# Altium schematic sheet A2-ESP.SchDoc
size A
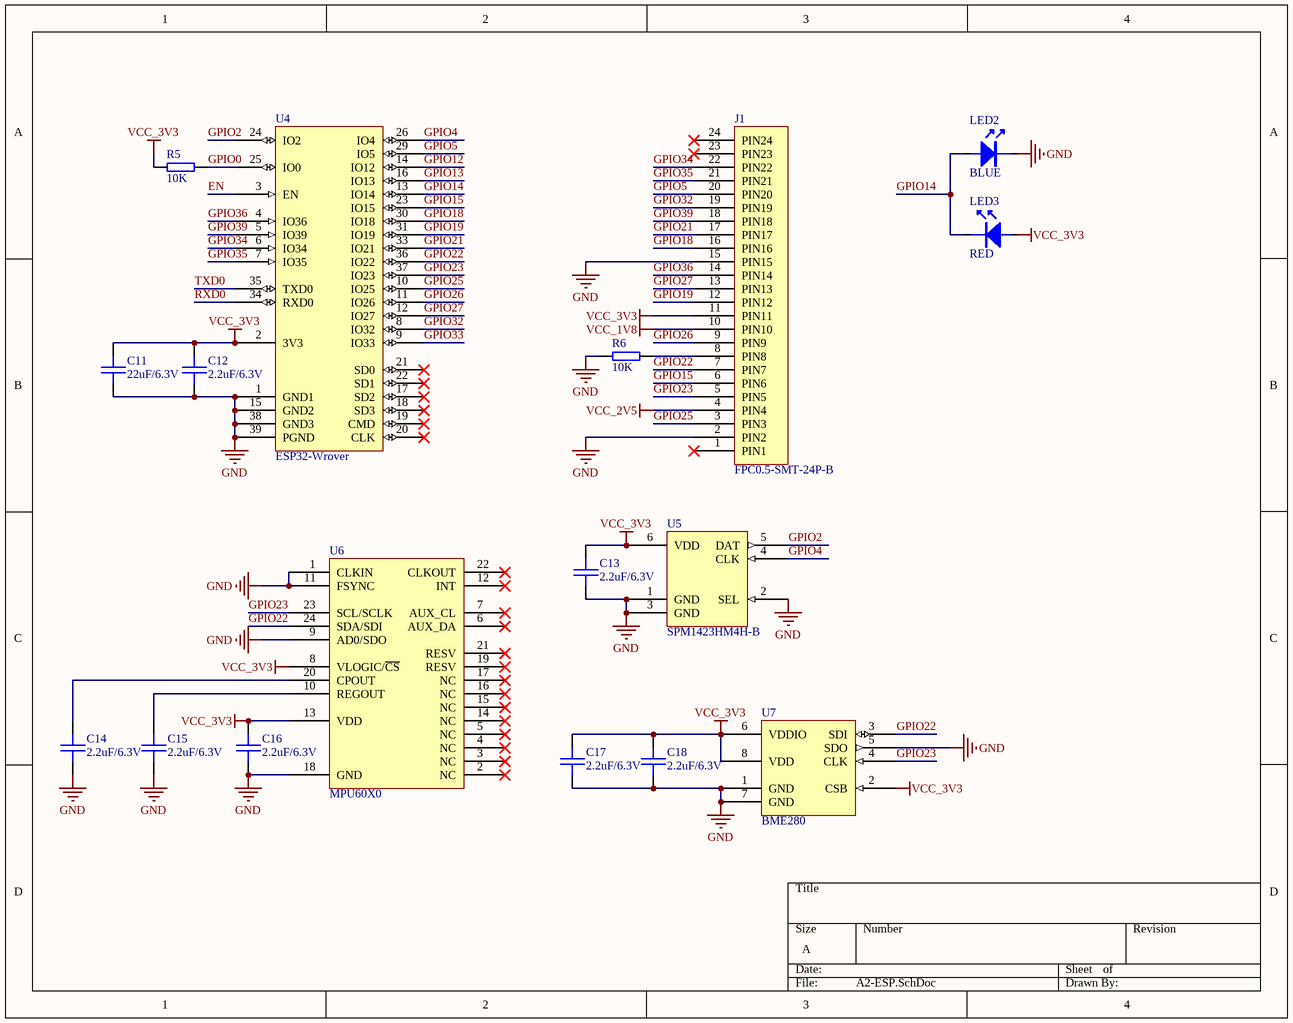
[diagram p0: A2-ESP.SchDoc]

## Parts
C11  22uF/6.3V  [SMT_C_0805]
C12  2.2uF/6.3V  [SMT_C_0402]
C13  2.2uF/6.3V  [SMT_C_0402]
C14  2.2uF/6.3V  [SMT_C_0402]
C15  2.2uF/6.3V  [SMT_C_0402]
C16  2.2uF/6.3V  [SMT_C_0402]
C17  2.2uF/6.3V  [SMT_C_0402]
C18  2.2uF/6.3V  [SMT_C_0402]
J1  FPC0.5-SMT-24P-B  [FPC0.5-SMT-24P-B-DRAWER]
LED2  BLUE  [SMT_LED_0402]
LED3  RED  [SMT_LED_0402]
R5  10K  [SMT_R_0402]
R6  10K  [SMT_R_0402]
U4  ESP32-Wrover  [ESP32-WROVER]
U5  SPM1423HM4H-B  [SPM1423HM4H-B]
U6  MPU60X0  [MPU60X0]
U7  BME280  [BME280]

## Nets
GND: C11.2 C12.1 C13.1 C14.1 C15.1 C16.1 C17.1 C18.1 J1.2(PIN2) J1.15(PIN15) LED2.2(K) R6.2 U4.1(GND1) U4.15(GND2) U4.38(GND3) U4.39(PGND) U5.1(GND) U5.2(SEL) U5.3(GND) U6.1(CLKIN) U6.9(AD0/SDO) U6.11(FSYNC) U6.18(GND) U7.1(GND) U7.5(SDO) U7.7(GND)
VCC_1V8: J1.10(PIN10)
VCC_2V5: J1.4(PIN4)
VCC_3V3: C11.1 C12.2 C13.2 C16.2 C17.2 C18.2 J1.11(PIN11) LED3.1(A) R5.2 U4.2(3V3) U5.6(VDD) U6.8(VLOGIC/~{CS}) U6.13(VDD) U7.2(CSB) U7.6(VDDIO) U7.8(VDD)
EN: U4.3(EN)
GPIO0: R5.1 U4.25(IO0)
GPIO2: U4.24(IO2) U5.5(DAT)
GPIO4: U4.26(IO4) U5.4(CLK)
GPIO5: J1.20(PIN20) U4.29(IO5)
GPIO12: U4.14(IO12)
GPIO13: U4.16(IO13)
GPIO14: LED2.1(A) LED3.2(K) U4.13(IO14)
GPIO15: J1.6(PIN6) U4.23(IO15)
GPIO18: J1.16(PIN16) U4.30(IO18)
GPIO19: J1.12(PIN12) U4.31(IO19)
GPIO21: J1.17(PIN17) U4.33(IO21)
GPIO22: J1.7(PIN7) U4.36(IO22) U6.24(SDA/SDI) U7.3(SDI)
GPIO23: J1.5(PIN5) U4.37(IO23) U6.23(SCL/SCLK) U7.4(CLK)
GPIO25: J1.3(PIN3) U4.10(IO25)
GPIO26: J1.9(PIN9) U4.11(IO26)
GPIO27: J1.13(PIN13) U4.12(IO27)
GPIO32: J1.19(PIN19) U4.8(IO32)
GPIO33: U4.9(IO33)
GPIO34: J1.22(PIN22) U4.6(IO34)
GPIO35: J1.21(PIN21) U4.7(IO35)
GPIO36: J1.14(PIN14) U4.4(IO36)
GPIO39: J1.18(PIN18) U4.5(IO39)
RXD0: U4.34(RXD0)
TXD0: U4.35(TXD0)
NetC14_2: C14.2 U6.20(CPOUT)
NetC15_2: C15.2 U6.10(REGOUT)
NetJ1_8: J1.8(PIN8) R6.1

Not connected (* = marked no-connect by the designer): J1 1(PIN1)* 23(PIN23)* 24(PIN24)*; U4 17(SD2)* 18(SD3)* 19(CMD)* 20(CLK)* 21(SD0)* 22(SD1)*; U6 2(NC)* 3(NC)* 4(NC)* 5(NC)* 6(AUX_DA)* 7(AUX_CL)* 12(INT)* 14(NC)* 15(NC)* 16(NC)* 17(NC)* 19(RESV)* 21(RESV)* 22(CLKOUT)*

## Library data of the parts
C11 = SMT_C_0805: Surface mount capacitor 0805
C12-C18 = SMT_C_0402: Surface mount capacitor 0402
LED2 LED3 = SMT_LED_0402: SMT LED
R5 R6 = SMT_R_0402: Surface mount resistor 0402
U6 = MPU60X0: MPU60X0 Six-Axis (Gyro + Accelerometer) MEMS